# EAGLE design RFM69HCW (EAGLE 8.0.1)
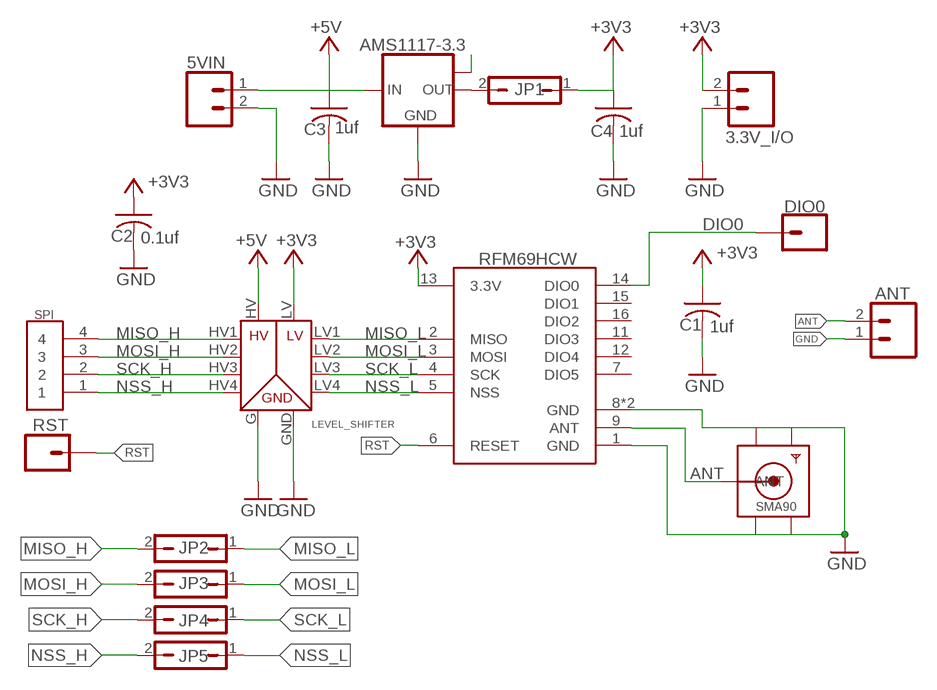
[diagram p0: schematic, sheet 1]

## Parts
3.3V_I/O  M021X02_NO_SILK  [1X02_NO_SILK]
5VIN  M021X02_NO_SILK  [1X02_NO_SILK]
AMS1117-3.3  LM1117MPX-1.8  [SOT223]
ANT  M021X02_NO_SILK  [1X02_NO_SILK]
C1  1uf  C-USC0805  [C0805]
C2  0.1uf  C-USC0805  [C0805]
C3  1uf  C-USC0805  [C0805]
C4  1uf  C-USC0805  [C0805]
DIO0  M01SMDNS  [1X01NS]
JP1  JP1Q  [JP1]
JP2  JP1Q  [JP1]
JP3  JP1Q  [JP1]
JP4  JP1Q  [JP1]
JP5  JP1Q  [JP1]
RST  M01SMDNS  [1X01NS]
SMA90  SMACONNECTOR_EDGE  [SMA_EDGELAUNCH]
SPI  1X4-CLEANBIG  [1X04-CLEANBIG]
U1  RFM69HCW  [RFM69HCW-XXXS2]
U$1  LEVEL_SHIFTER  [LEVEL_SHIFTER]

## Nets
+3V3: 3.3V_I/O.2 C1.1 C2.1 C4.1 JP1.1 U1.13(3.3V) U$1.LV
+5V: 5VIN.1 AMS1117-3.3.3(IN) C3.1 U$1.HV
ANT: ANT.2 SMA90.P(ANT) U1.9(ANT)
DIO0: DIO0.1 U1.14(DIO0)
GND: 3.3V_I/O.1 5VIN.2 AMS1117-3.3.1(GND) ANT.1 C1.2 C2.2 C3.2 C4.2 SMA90.GND@1(GND4) SMA90.GND@2(GND3) SMA90.GND@3(GND2) SMA90.GND@4(GND1) U1.1(GND) U1.8(GND) U1.10(GND) U$1.G(GND) U$1.GND(GND1)
MISO_H: JP2.2 SPI.4 U$1.HV1
MISO_L: JP2.1 U1.2(MISO) U$1.LV1
MOSI_H: JP3.2 SPI.3 U$1.HV2
MOSI_L: JP3.1 U1.3(MOSI) U$1.LV2
N$1: AMS1117-3.3.2(OUT) JP1.2
N$3: AMS1117-3.3.TAB(OUT1)
NSS_H: JP5.2 SPI.1 U$1.HV4
NSS_L: JP5.1 U1.5(NSS) U$1.LV4
RST: RST.1 U1.6(RESET)
SCK_H: JP4.2 SPI.2 U$1.HV3
SCK_L: JP4.1 U1.4(SCK) U$1.LV3
Unconnected: U1.7(DIO5) U1.11(DIO3) U1.12(DIO4) U1.15(DIO1) U1.16(DIO2)

## Library data of the parts
3.3V_I/O 5VIN ANT = mike-temp:M02: Header 2 Standard 2-pin 0.1" header. Use with straight break away headers (SKU : PRT-00116), right angle break away headers (PRT-00553), swiss pins (PRT-00743), machine pins (PRT-00117), and female headers (PRT-00115). Molex polarized connector foot print use with SKU : PRT-08233 with associated crimp pins and housings.
AMS1117-3.3 = lm1117:LM1117MPX-*
C1-C4 = adafruit:C-US: CAPACITOR, American symbol
DIO0 RST = mike-temp:M01: Header 1 Standard 1-pin 0.1" header. Use with straight break away headers (SKU : PRT-00116), right angle break away headers (PRT-00553), swiss pins (PRT-00743), machine pins (PRT-00117), and female headers (PRT-00115).
JP1-JP5 = jumper:JP1Q: JUMPER
SMA90 = adafruit:SMACONNECTOR: SMA Connector 90° DIP SMA Connector, 50 Ohm (4UConnector: 07259)
SPI = adafruit:1X4: 4-pin connector
U1 = mike-temp:RFM69H
U$1 = LEVEL_SHIFTER:LEVEL_SHIFTER: level_shifter

## Net classes
0 default: clearance 0.178 mm

## Board
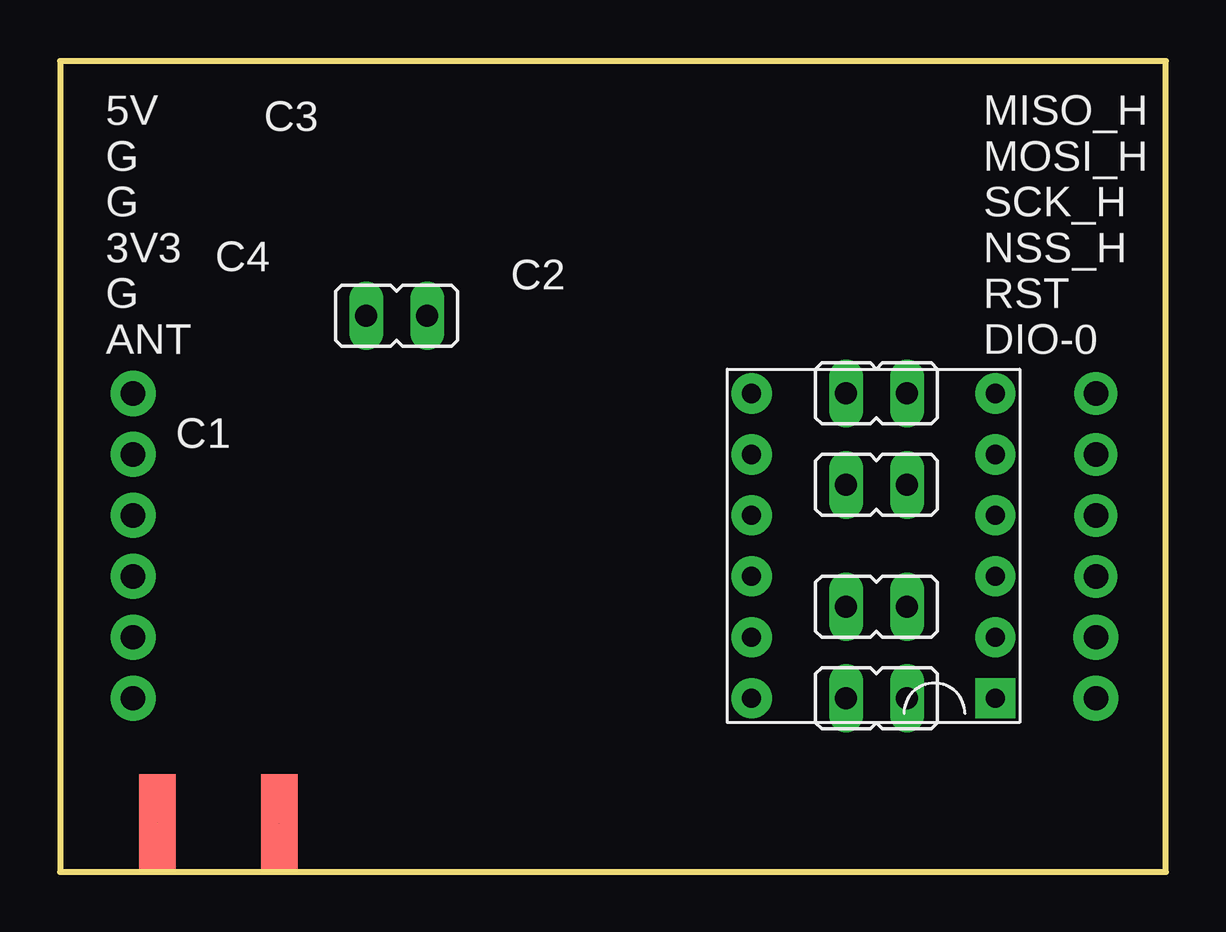
[diagram p1: board, top side]
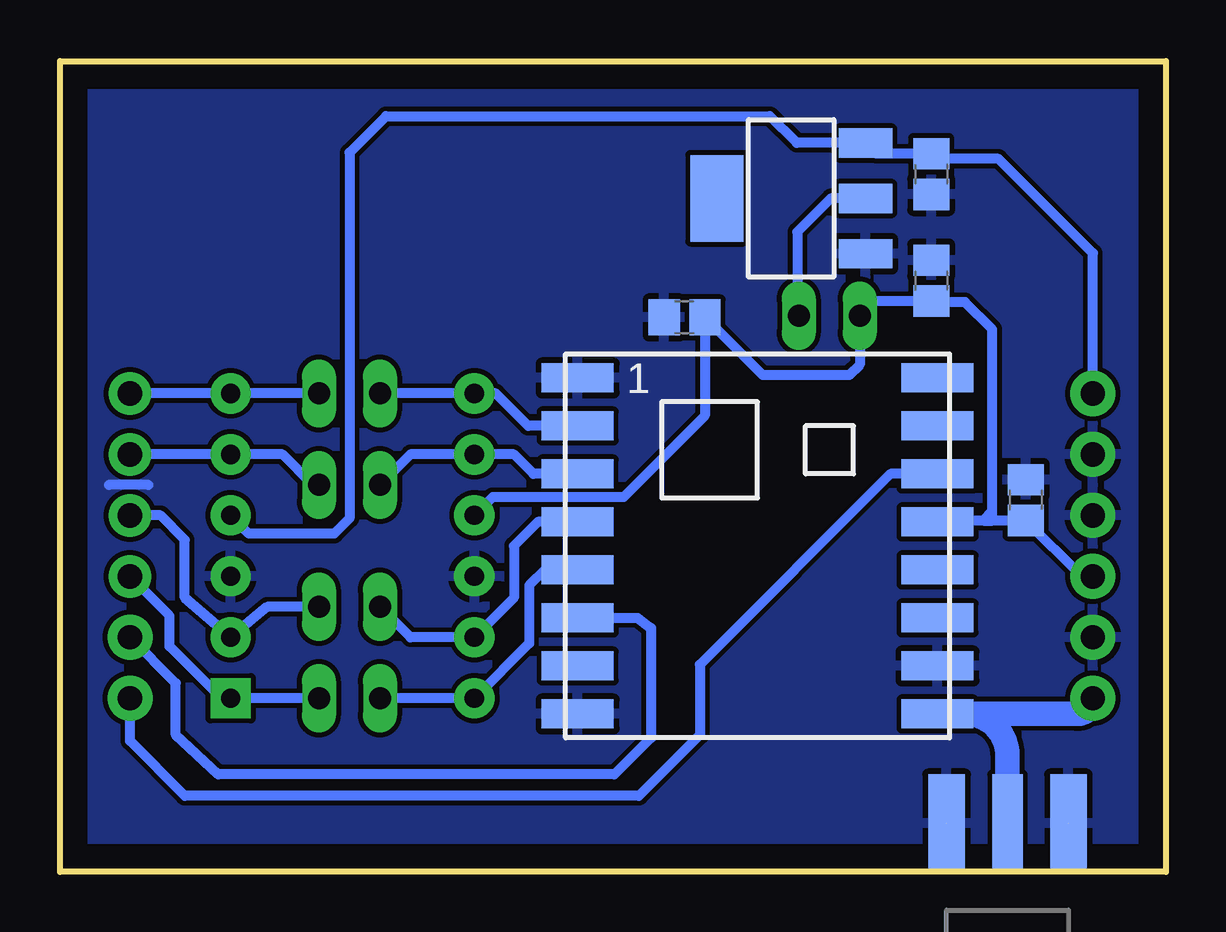
[diagram p2: board, bottom side, seen from below]

Size 46.1 x 33.83 mm. Coordinates in mm from the lower left corner, seen from the top.
Outline: 0,0 46.08,0 46.08,33.83 0.38,33.83 0,33.78
Outline: 0,33.78 0,0
Outline: 0,0 46.1,0 46.1,33.78 0,33.78
Copper layers (1*16): Top 0.035mm / dielectric 1.5mm / Bottom 0.035mm
Design rules "default": minimum track width 10mil, minimum drill 24mil, track to track 8mil, track to pad 8mil, pad to pad 8mil, via to via 8mil, smd to smd 8mil, copper to edge 40mil, drill to drill 8mil, minimum pad ring 10mil, minimum via ring 8mil, stop-mask expansion 4mil, vias tented up to drill 0mil, thermal gap 10mil

### Footprints (pad centres in the part's own frame; a part is rotated, then mirrored left to right if it is on the bottom)
1X02_NO_SILK = drill 1.016 pad 1.88: 1 0,0; 2 2.54,0
SOT223 = smd 1.219 x 2.235: 1 -2.311,-3.099; 2 0,-3.099; 3 2.311,-3.099 | smd 3.6 x 2.2: TAB 0,3.099
C0805 = smd 1.3 x 1.5: 1 -0.85,0; 2 0.85,0
1X01NS = drill 1.016 pad 1.88: 1 0,0
JP1 = drill 0.914 long: 1 0,-1.27; 2 0,1.27
SMA_EDGELAUNCH = smd 4.064 x 1.524: GND@1 2.032,-2.54; GND@2 2.032,2.54 | smd 4.064 x 1.524 bottom: GND@3 2.032,2.54; GND@4 2.032,-2.54 | smd 4.064 x 1.27: P 2.032,0
1X04-CLEANBIG = drill 1.016 pad 1.778: 1 -3.81,0; 2 -1.27,0; 3 1.27,0; 4 3.81,0
RFM69HCW-XXXS2 = smd 3 x 1.2: 1 -7.5,7; 2 -7.5,5; 3 -7.5,3; 4 -7.5,1; 5 -7.5,-1; 6 -7.5,-3; 7 -7.5,-5; 8 -7.5,-7; 9 7.5,-7; 10 7.5,-5; 11 7.5,-3; 12 7.5,-1; 13 7.5,1; 14 7.5,3; 15 7.5,5; 16 7.5,7
LEVEL_SHIFTER = drill 0.8 pad 1.676: G 10.16,-5.08; GND 0,-5.08; HV 0,-7.62; HV1 0,-12.7; HV2 0,-10.16; HV3 0,-2.54; LV 10.16,-7.62; LV1 10.16,-12.7; LV2 10.16,-10.16; LV3 10.16,-2.54; LV4 10.16,0 | drill 0.8 pad 1.676 square: HV4 0,0

### Placement (x,y rotation side)
3.3V_I/O  3.05,14.86 270 top
5VIN  3.05,19.94 270 top
AMS1117-3.3  15.62,28.07 90 bottom
ANT  3.05,9.78 270 top
C1  5.84,15.49 90 bottom
C2  20.07,23.11 180 bottom
C3  9.78,29.08 270 bottom
C4  9.78,24.64 90 bottom
DIO0  43.18,7.24 0 top
JP1  14.03,23.18 270 top
JP2  34.04,19.94 270 top
JP3  34.04,16.13 270 top
JP4  34.04,11.05 270 top
JP5  34.04,7.24 270 top
RST  43.18,9.78 0 top
SMA90  6.6,0 90 bottom
SPI  43.18,16.13 90 top
U1  17.02,13.59 0 bottom
U$1  38.99,7.24 180 top

### Tracks (layer width: path | path; a pad name or v marks a point on that pad's centre or on a via)
+3V3
  Bottom 0.406: 3.3V_I/O.2 3.52,12.32 C1.1 7.24,14.64 | 7.62,14.64 7.24,14.64 | 7.62,14.64 9.46,14.64 U1.13 | 7.24,14.64 7.24,15.03 | 7.24,15.03 7.24,22.61 8.38,23.75 9.74,23.75 C4.1 12.15,23.79 JP1.1 12.76,21.15 13.21,20.7 16.8,20.7 C2.1 19.22,19.01 22.61,15.62 28.07,15.62 U$1.LV | 7.24,15.03 7.62,14.64
+5V
  Bottom 0.406: 5VIN.1 3.05,25.78 6.99,29.72 9.56,29.72 C3.1 12.08,29.93 AMS1117-3.3.3 15.39,30.38 16.51,31.5 32.51,31.5 34.04,29.97 34.04,14.73 34.67,14.1 38.23,14.1 U$1.HV
ANT
  Bottom 1.016: ANT.2 arc90 3.7,6.59 U1.9 8.37,6.59 arc90 6.6,4.83 SMA90.P
DIO0
  Bottom 0.406: U1.14 11.48,16.59 19.43,8.64 19.43,5.71 21.97,3.17 40.89,3.17 43.18,5.46 DIO0.1
GND  (2 unrouted)
  Bottom 0.406: 42.42,16.13 44.07,16.13
  pour Bottom: -0.89,35.05 47.37,35.05 47.37,-0.89 -0.89,-0.89
MISO_H
  Bottom 0.406: JP2.2 U$1.HV1 SPI.4
MISO_L
  Bottom 0.406: JP2.1 U$1.LV1 27.94,19.94 26.59,18.59 U1.2
MOSI_H
  Bottom 0.406: SPI.3 U$1.HV2 36.83,17.4 35.56,16.13 JP3.2
MOSI_L
  Bottom 0.406: JP3.1 31.5,17.4 U$1.LV2 27.18,17.4 26.37,16.59 U1.3
N$1
  Bottom 0.406: AMS1117-3.3.2 13.97,28.07 15.37,26.67 15.37,23.24 JP1.2
NSS_H
  Bottom 0.406: JP5.2 U$1.HV4 39.37,7.24 41.53,9.4 41.53,10.67 SPI.1
NSS_L
  Bottom 0.406: JP5.1 U$1.LV4 26.54,9.53 26.54,11.94 25.89,12.59 U1.5
RST
  Bottom 0.406: U1.6 22.02,10.59 21.46,10.16 21.46,5.59 22.99,4.06 39.5,4.06 41.28,5.71 41.28,7.87 RST.1
SCK_H
  Bottom 0.406: JP4.2 37.47,11.05 U$1.HV3 40.89,11.43 40.89,13.84 41.91,14.86 SPI.2
SCK_L
  Bottom 0.406: JP4.1 31.5,9.78 U$1.LV3 27.18,11.43 27.18,13.59 26.18,14.59 U1.4

### Text on the board
tNames: 5V / G / G / 3V3 / G / ANT | MISO_H / MOSI_H / SCK_H / NSS_H / RST / DIO-0